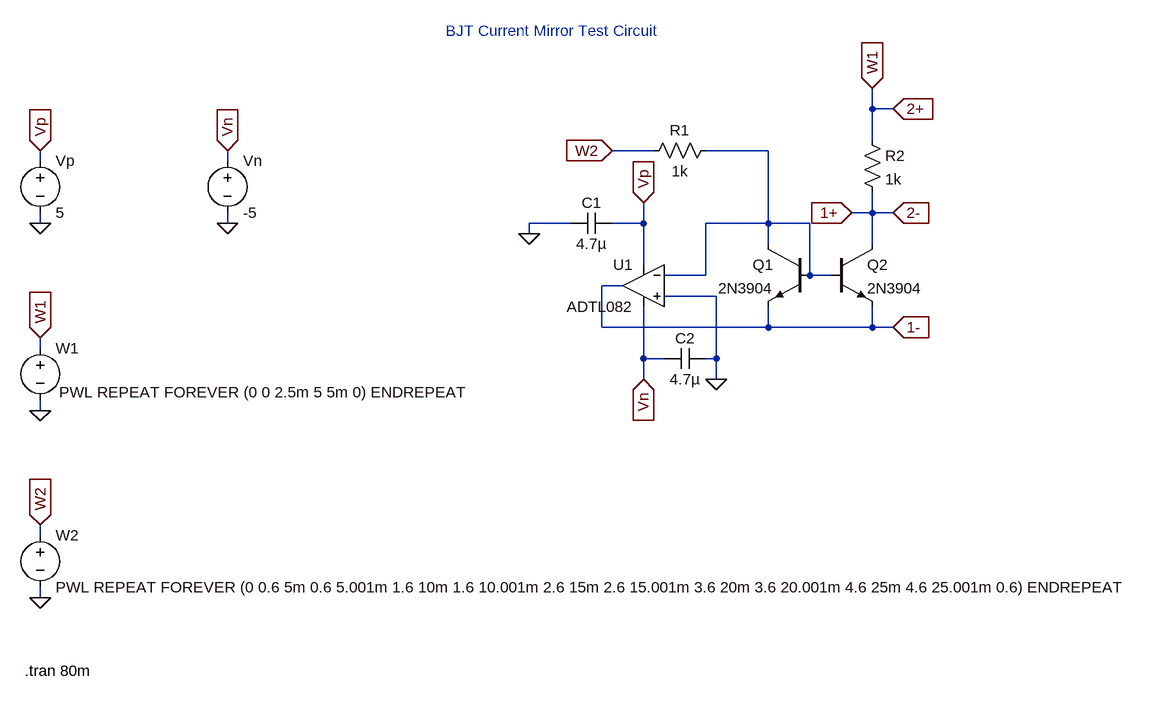
[diagram p0: schematic current_mirror_test.asc]
current_mirror_test.asc, the LTspice schematic file:
Version 4
SHEET 1 2016 1044
WIRE 496 -80 496 -112
WIRE 528 -80 496 -80
WIRE 496 -32 496 -80
WIRE 160 -16 96 -16
WIRE 336 -16 240 -16
WIRE -784 0 -784 -16
WIRE -496 0 -496 -16
WIRE 496 80 496 48
WIRE 496 80 464 80
WIRE 528 80 496 80
WIRE -784 96 -784 80
WIRE -496 96 -496 80
WIRE 32 96 -32 96
WIRE 144 96 144 64
WIRE 144 96 96 96
WIRE 336 96 336 -16
WIRE 336 96 240 96
WIRE 400 96 336 96
WIRE -32 112 -32 96
WIRE 336 128 336 96
WIRE 496 128 496 80
WIRE 144 160 144 96
WIRE 240 176 240 96
WIRE 240 176 176 176
WIRE 400 176 400 96
WIRE 432 176 400 176
WIRE 112 192 80 192
WIRE 256 208 176 208
WIRE 80 256 80 192
WIRE 336 256 336 224
WIRE 336 256 80 256
WIRE 496 256 496 224
WIRE 496 256 336 256
WIRE 528 256 496 256
WIRE -784 288 -784 272
WIRE 144 304 144 224
WIRE 176 304 144 304
WIRE 256 304 256 208
WIRE 256 304 240 304
WIRE 144 336 144 304
WIRE 256 336 256 304
WIRE -784 384 -784 368
WIRE -784 576 -784 560
WIRE -784 672 -784 656
FLAG -32 112 0
FLAG 256 336 0
FLAG 144 336 Vn
IOPIN 144 336 In
FLAG 496 -112 W1
IOPIN 496 -112 In
FLAG 96 -16 W2
IOPIN 96 -16 In
FLAG 144 64 Vp
IOPIN 144 64 In
FLAG 528 -80 2+
IOPIN 528 -80 In
FLAG 528 80 2-
IOPIN 528 80 In
FLAG 528 256 1-
IOPIN 528 256 In
FLAG 464 80 1+
IOPIN 464 80 In
FLAG -784 96 0
FLAG -784 384 0
FLAG -784 672 0
FLAG -496 96 0
FLAG -784 -16 Vp
IOPIN -784 -16 In
FLAG -496 -16 Vn
IOPIN -496 -16 In
FLAG -784 272 W1
IOPIN -784 272 In
FLAG -784 560 W2
IOPIN -784 560 In
SYMBOL Opamps\\ADTL082 144 128 M0
SYMATTR InstName U1
SYMBOL cap 32 112 R270
WINDOW 0 32 32 VTop 2
WINDOW 3 0 32 VBottom 2
SYMATTR InstName C1
SYMATTR Value 4.7µ
SYMBOL cap 176 320 R270
WINDOW 0 32 32 VTop 2
WINDOW 3 0 32 VBottom 2
SYMATTR InstName C2
SYMATTR Value 4.7µ
SYMBOL res 256 -32 R90
WINDOW 0 0 56 VBottom 2
WINDOW 3 32 56 VTop 2
SYMATTR InstName R1
SYMATTR Value 1k
SYMBOL npn 400 128 M0
SYMATTR InstName Q1
SYMATTR Value 2N3904
SYMBOL npn 432 128 R0
SYMATTR InstName Q2
SYMATTR Value 2N3904
SYMBOL res 480 -48 R0
SYMATTR InstName R2
SYMATTR Value 1k
SYMBOL voltage -784 -16 R0
SYMATTR InstName Vp
SYMATTR Value 5
SYMBOL voltage -784 272 R0
WINDOW 3 29 84 Left 2
WINDOW 123 0 0 Left 0
WINDOW 39 0 0 Left 0
SYMATTR Value PWL REPEAT FOREVER (0 0 2.5m 5 5m 0) ENDREPEAT
SYMATTR InstName W1
SYMBOL voltage -496 -16 R0
SYMATTR InstName Vn
SYMATTR Value -5
SYMBOL voltage -784 560 R0
WINDOW 123 0 0 Left 0
WINDOW 39 0 0 Left 0
SYMATTR InstName W2
SYMATTR Value PWL REPEAT FOREVER (0 0.6 5m 0.6 5.001m 1.6 10m 1.6 10.001m 2.6 15m 2.6 15.001m 3.6 20m 3.6 20.001m 4.6 25m 4.6 25.001m 0.6) ENDREPEAT
TEXT -160 -200 Left 2 ;BJT Current Mirror Test Circuit
TEXT -808 784 Left 2 !.tran 80m

The netlist it stands for:
* current_mirror_test.asc
XU1 0 N001 Vp Vn 1- ADTL082  ; pins In+ In- V+ V- OUT
C1 0 Vp 4.7µ
C2 Vn 0 4.7µ
R1 N001 W2 1k
Q1 N001 N001 1- 0 2N3904
Q2 1+ N001 1- 0 2N3904
R2 2+ 1+ 1k
Vp Vp 0 5
V§W1 2+ 0 PWL REPEAT FOREVER (0 0 2.5m 5 5m 0) ENDREPEAT
Vn Vn 0 -5
V§W2 W2 0 PWL REPEAT FOREVER (0 0.6 5m 0.6 5.001m 1.6 10m 1.6 10.001m 2.6 15m 2.6 15.001m 3.6 20m 3.6 20.001m 4.6 25m 4.6 25.001m 0.6) ENDREPEAT
.model NPN NPN
.model PNP PNP
.lib standard.bjt
* BJT Current Mirror Test Circuit
.tran 80m
.lib ADI.lib
.backanno
.end